# Altium project Controlador de velocidad v2.PrjPcb
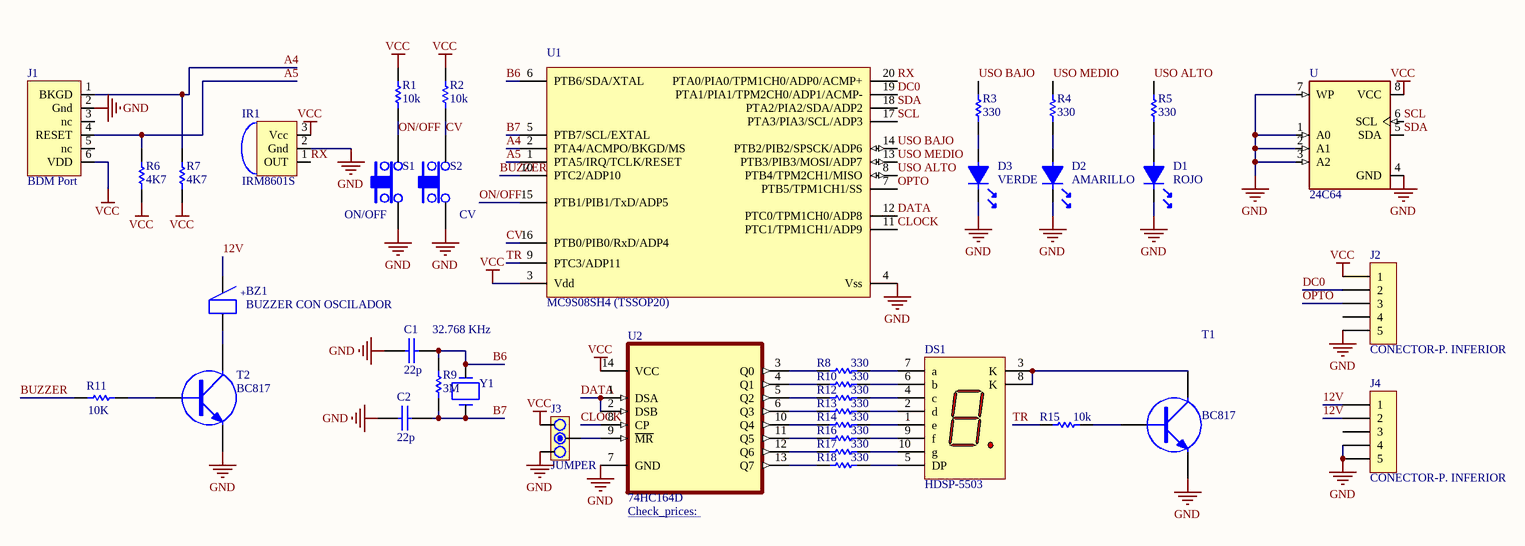
[diagram p0: Controlador de velocidad v2.SchDoc]
1 sheet, 38 parts. Net scope: global (net labels, ports and power ports of the same name join across sheets).
Board file: Controlador de velocidad v2.PcbDoc

## Sheet Controlador de velocidad v2.SchDoc
size A4

### Parts
BZ1  BUZZER CON OSCILADOR  [BUZZER 12MM]
C1  22p  [0805]
C2  22p  [0805]
D1  ROJO  [LED5]
D2  AMARILLO  [LED5]
D3  VERDE  [LED5]
DS1  HDSP-5503  [H-10]
IR1  IRM8601S  [IRM8601S]
J1  BDM Port  [JBDM]
J2  CONECTOR-P. INFERIOR  [SIP5]
J3  JUMPER  [JUMPER3]
J4  CONECTOR-P. INFERIOR  [SIP5]
R1  10k  [0805]
R2  10k  [0805]
R3  330  [0805]
R4  330  [0805]
R5  330  [0805]
R6  4K7  [0805]
R7  4K7  [0805]
R8  330  [0805]
R9  3M  [0805]
R10  330  [0805]
R11  10K  [0805]
R12  330  [0805]
R13  330  [0805]
R14  330  [0805]
R15  10k  [0805]
R16  330  [0805]
R17  330  [0805]
R18  330  [0805]
S1  ON/OFF  [TACTSWITCH]
S2  CV  [TACTSWITCH]
T1  BC817  [SOT23]
T2  BC817  [SOT23]
U  24C64  [SOIC127P600X175-8N]
U1  MC9S08SH4 (TSSOP20)  [TSSOP20]
U2  74HC164D  [SOIC127P600X175-14N]
Y1  32.768 KHz  [X32768]

### Nets
GND: C1.2 C2.2 D1.2 D2.2 D3.2 IR1.2(Gnd) J1.2(Gnd) J2.5 J3.1 J4.4 J4.5 S1.1 S2.1 T1.3(E) T2.3(E) U.1(A0) U.2(A1) U.3(A2) U.4(GND) U.7(WP) U1.4(Vss) U2.7(GND)
VCC: IR1.3(Vcc) J1.6(VDD) J2.1 J3.3 R1.2 R2.2 R6.1 R7.1 U.8(VCC) U1.3(Vdd) U2.14(VCC)
12V: BZ1.1 J4.1 J4.2
A4: J1.1(BKGD) R7.2 U1.2(PTA4/ACMPO/BKGD/MS)
A5: J1.4(RESET) R6.2 U1.1(PTA5/IRQ/TCLK/RESET)
B6: C1.1 R9.2 U1.6(PTB6/SDA/XTAL) Y1.2
B7: C2.1 R9.1 U1.5(PTB7/SCL/EXTAL) Y1.1
BUZZER: R11.1 U1.10(PTC2/ADP10)
CLOCK: U1.11(PTC1/TPM1CH1/ADP9) U2.8(CP)
CV: R2.1 S2.2 U1.16(PTB0/PIB0/RxD/ADP4)
DATA: U1.12(PTC0/TPM1CH0/ADP8) U2.1(DSA) U2.2(DSB)
DC0: J2.2 U1.19(PTA1/PIA1/TPM2CH0/ADP1/ACMP-)
ON/OFF: R1.1 S1.2 U1.15(PTB1/PIB1/TxD/ADP5)
OPTO: J2.3 U1.7(PTB5/TPM1CH1/SS)
RX: IR1.1(OUT) U1.20(PTA0/PIA0/TPM1CH0/ADP0/ACMP+)
SCL: U.6(SCL) U1.17(PTA3/PIA3/SCL/ADP3)
SDA: U.5(SDA) U1.18(PTA2/PIA2/SDA/ADP2)
TR: R15.1 U1.9(PTC3/ADP11)
USO ALTO: R5.2 U1.8(PTB4/TPM2CH1/MISO)
USO BAJO: R3.2 U1.14(PTB2/PIB2/SPSCK/ADP6)
USO MEDIO: R4.2 U1.13(PTB3/PIB3/MOSI/ADP7)
NetBZ1_2: BZ1.2 T2.2(C)
NetD1_1: D1.1 R5.1
NetD2_1: D2.1 R4.1
NetD3_1: D3.1 R3.1
NetDS1_1: DS1.1(e) R14.2
NetDS1_2: DS1.2(d) R13.2
NetDS1_3: DS1.3(K) DS1.8(K) T1.2(C)
NetDS1_4: DS1.4(c) R12.2
NetDS1_5: DS1.5(DP) R18.2
NetDS1_6: DS1.6(b) R10.2
NetDS1_7: DS1.7(a) R8.2
NetDS1_9: DS1.9(f) R16.2
NetDS1_10: DS1.10(g) R17.2
NetJ3_2: J3.2 U2.9(~{MR})
NetR8_1: R8.1 U2.3(Q0)
NetR10_1: R10.1 U2.4(Q1)
NetR11_2: R11.2 T2.1(B)
NetR12_1: R12.1 U2.5(Q2)
NetR13_1: R13.1 U2.6(Q3)
NetR14_1: R14.1 U2.10(Q4)
NetR15_2: R15.2 T1.1(B)
NetR16_1: R16.1 U2.11(Q5)
NetR17_1: R17.1 U2.12(Q6)
NetR18_1: R18.1 U2.13(Q7)

Not connected (* = marked no-connect by the designer): J1 3(nc) 5(nc); J2 4; J4 3

### Notes on the sheet
- (in symbol BUZZER) +

### Library data of the parts
BZ1 = BUZZER
C1 C2 = CAP
D1-D3 = LED
DS1 = HDSP-5503: 14.22 mm Gray Surface HER 7-Segment Display: CC, RH DP; LuminousIntensity: 900 ucd (Minimum).; LED_Colour: High Efficiency Red (HER); Note: Pins 3 and 8 are redundant Cathodes.; Published: 26-May-2004; LatestRevisionDate: 11-Oct-2004; LatestRevisionNote: Display outline superimposed on PCB Footprint.; DatasheetDocument: 17-Jan-2002; PackageDocument: 24-Sep-2002; PackageReference: H-10; Publisher: Altium Limited; ComponentLink1Description: Manufacturer Link; ComponentLink1URL: http://www.agilent.com/; ComponentLink2Description: Datasheet; ComponentLink2URL: http://cp.literature.agilent.com/litweb/pdf/5988-4273EN.pdf
IR1 = IRM8601S: Sensor IR
J1 = JBDM
J2 J4 = CON5
J3 = JUMPER3
R1-R18 = RES
S1 S2 = TACT SWITCH: Supplier 1: Digi-Key; Supplier 2: Digi-Key
T1 T2 = TRANSISTOR NPN
U = AT24C256C-SSHL-T: EEPROM Memory IC 256Kb _32K x 8_ I²C 1MHz 550ns 8-SOIC; MF: Microchip; MP: AT24C256C-SSHL-T; SnapEDA_Link: https://www.snapeda.com/parts/AT24C256C-SSHL-T/Microchip/view-part/1864067/?ref=snap; Digi-Key_Part_Number: AT24C256C-SSHL-TCT-ND; Digi-Key_Purchase_URL: https://www.digikey.com/product-detail/en/microchip-technology/AT24C256C-SSHL-T/AT24C256C-SSHL-TCT-ND/3178468?utm_source=snapeda&utm_medium=aggregator&utm_campaign=symbol; Package: SO-8 Microchip; Value: *
U1 = MC9S08SH8_20
U2 = 74HC164D,653: Shift Shift Register 1 Element 8 Bit 14-SO; MF: Nexperia USA; DigiKey-Purchase-URL: https://snapeda.com/shop?store=DigiKey&id=1041733; Arrow_Asia-Purchase-URL: https://snapeda.com/shop?store=Arrow+Asia&id=1041733; Arrow_Europe-Purchase-URL: https://snapeda.com/shop?store=Arrow+Europe&id=1041733; Price: None; Availability: Good; Value: *; MP: 74HC164D,653; SnapEDA_Link: https://www.snapeda.com/parts/74HC164D,653/Nexperia%20USA%20Inc./view-part/1041733/?ref=snap; Package: SOIC-14 NXP Semiconductors; Mouser-Purchase-URL: https://snapeda.com/shop?store=Mouser&id=1041733; Arrow_Electronics-Purchase-URL: https://snapeda.com/shop?store=Arrow+Electronics&id=1041733
Y1 = CRYSTAL: Text Field1: 20; Text Field2: 20